# EasyEDA schematic SCH_minir2.json
TITLE: Sheet_1; REV: 1.0; Date: 2022-10-16; Sheet: 1/1; Drawn By: lilili123456; Company: Your Company
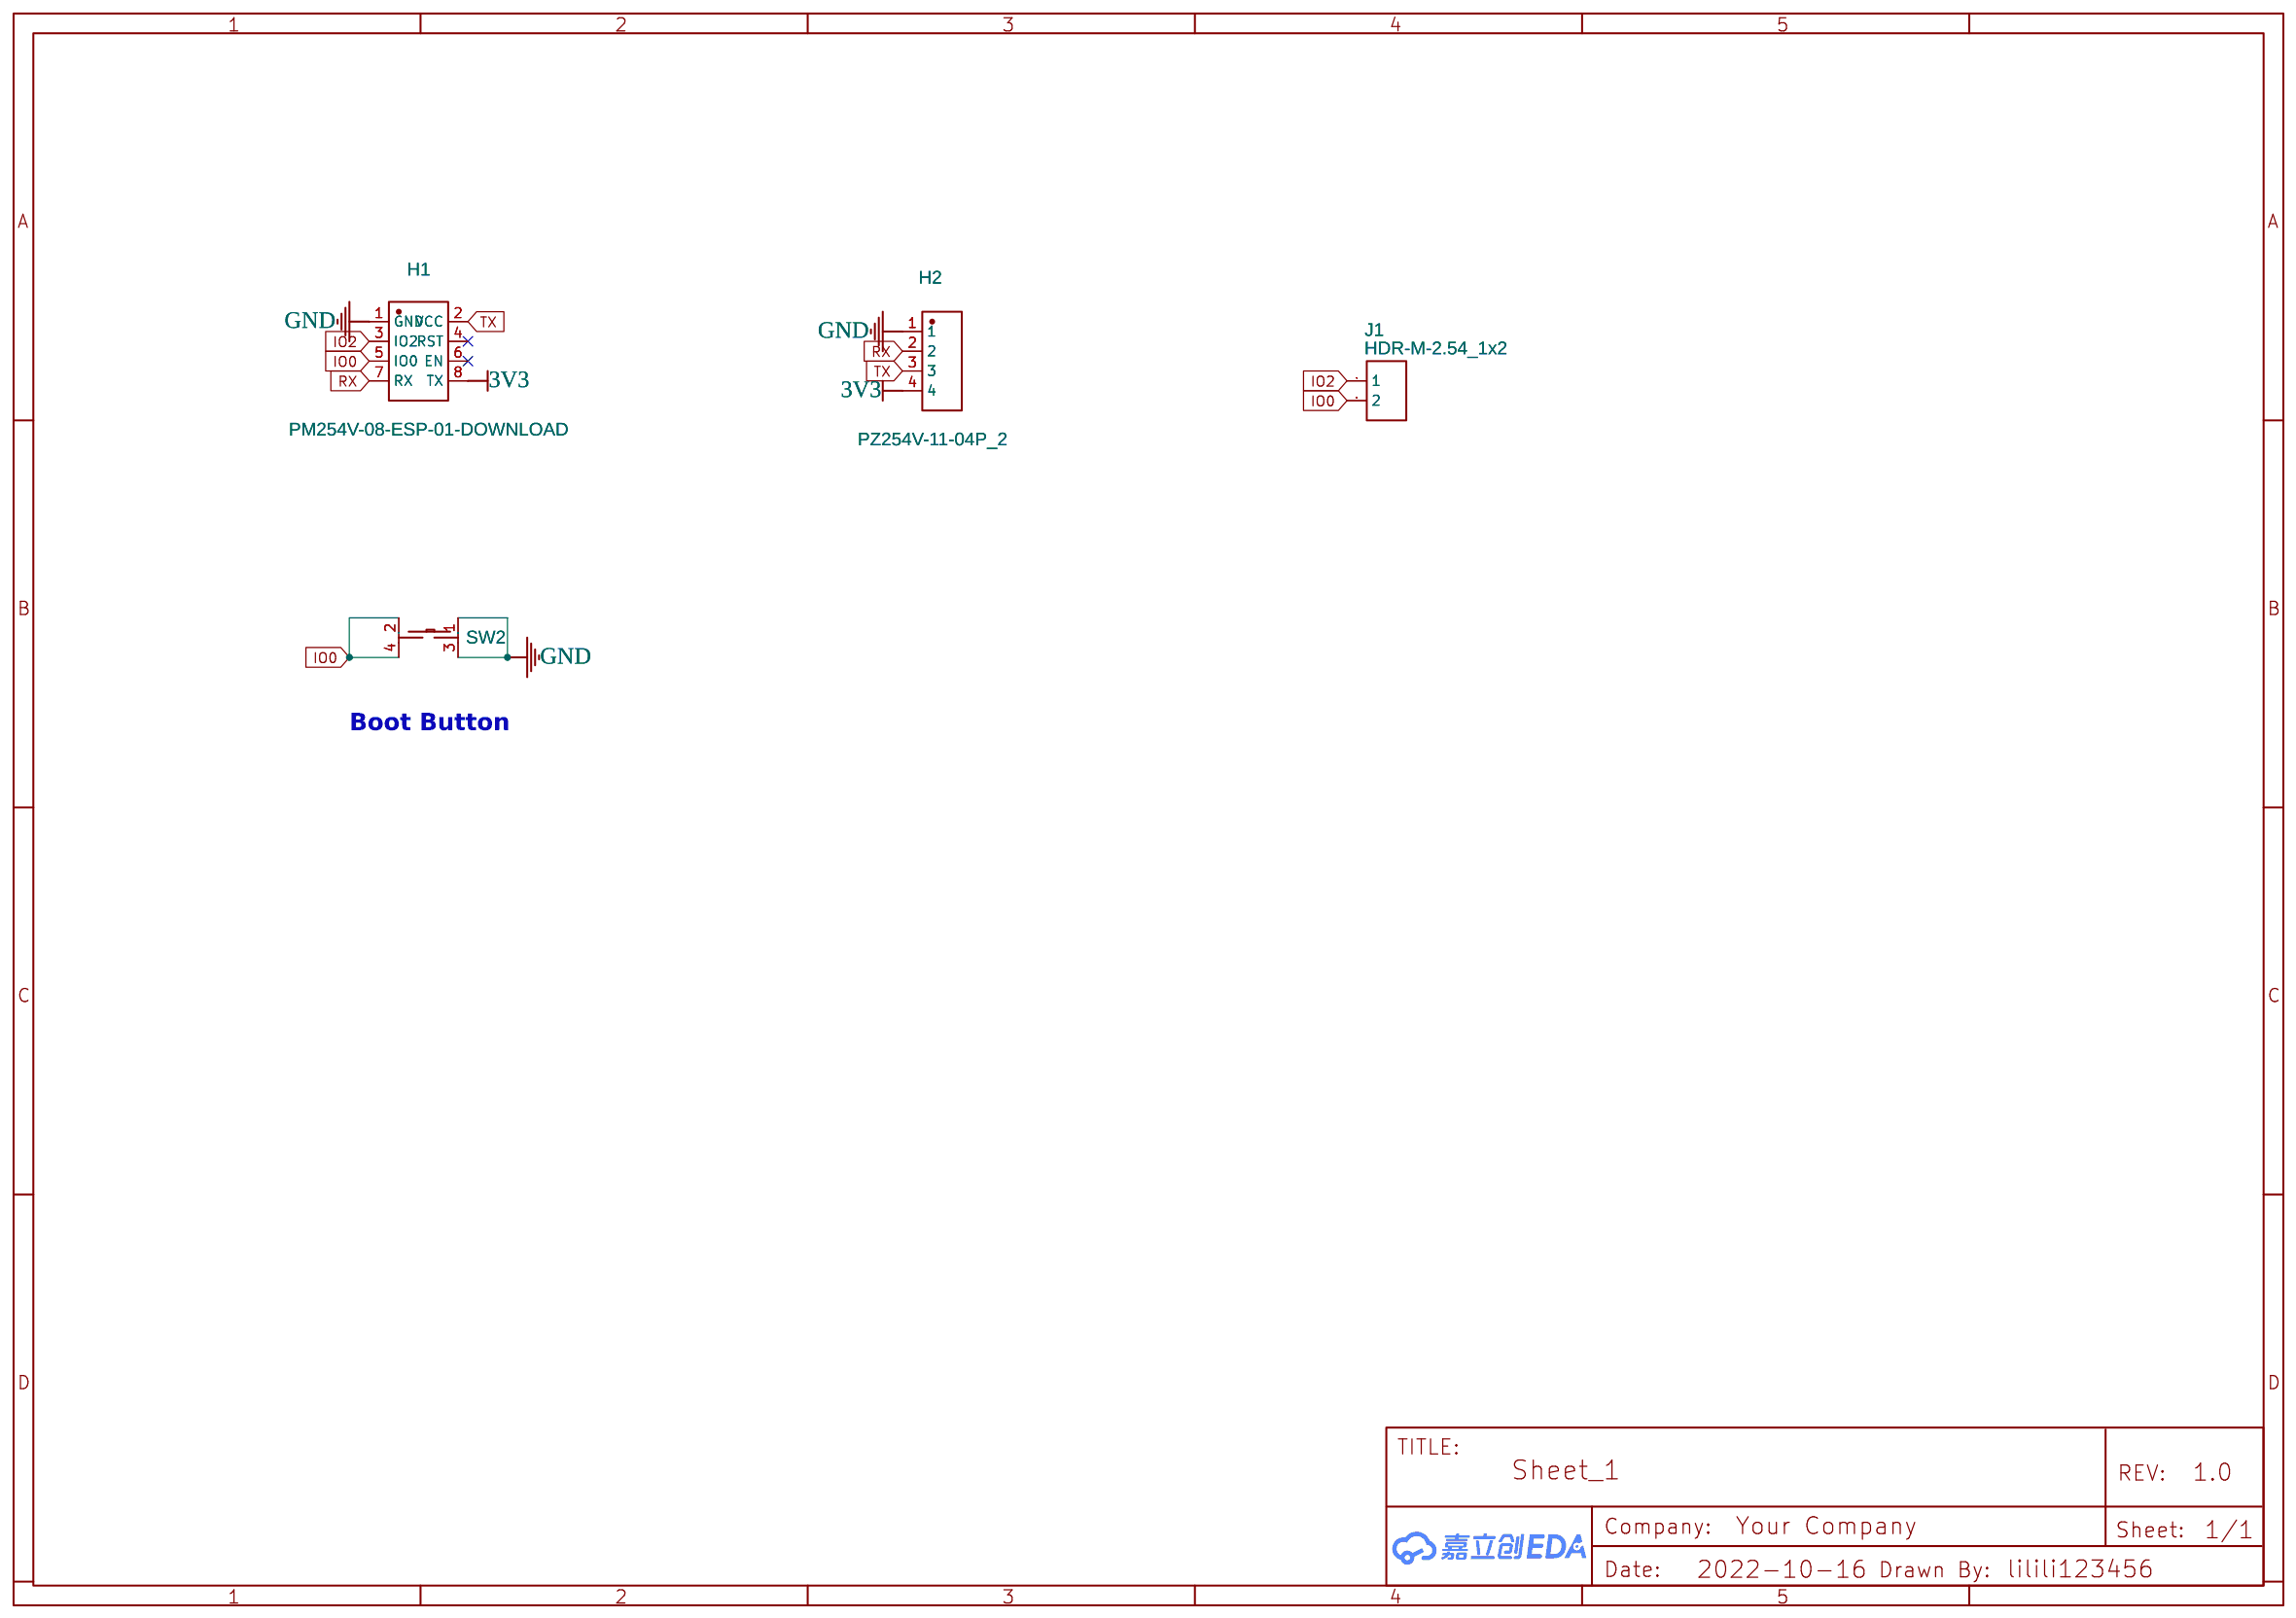
[diagram p0: schematic sheet]

## Parts
H1  PM254V-08-ESP-01-DOWNLOAD  [HDR-TH_8P-P2.54-V-F-DOWNLOAD]
H2  PZ254V-11-04P_2  [HDR-TH_4P-P2.54-V-M]
J1  HDR-M-2.54_1x2  [HDR-M-2.54_1X2]
SW2  K2-1849SN-A3DW-06_LL  [SW-SMD_4P-L3.0-W2.8-P1.7-LS3.5]

## Library data of the parts
H1 = PM254V-08-ESP-01-DOWNLOAD: Supplier: LCSC; Supplier Part: C2834799; Manufacturer: XFCN(台湾兴飞); Manufacturer Part: PM254V-12-08-H85; Contributor: lilili123456; JLCPCB Part Class: Extended Part; Convert to PCB: Yes; Add into BOM: Yes
H2 = PZ254V-11-04P_2: Supplier: LCSC; Supplier Part: C2691448; Manufacturer: XFCN(台湾兴飞); Manufacturer Part: PZ254V-11-04P; Contributor: lilili123456; JLCPCB Part Class: Extended Part
J1 = HDR-M-2.54_1x2: Supplier Part: C124375; Supplier: LCSC; Contributor: LCEDA_Lib
SW2 = K2-1849SN-A3DW-06_LL: Supplier: LCSC; Supplier Part: C442593; Manufacturer: Korean Hroparts Elec; Manufacturer Part: K2-1849SN-A3DW-06; Contributor: lilili123456; JLCPCB Part Class: Extended Part

## Nets
3V3: H1.8(TX) H2.4
GND: H1.1(GND) H2.1 SW2.1 SW2.3
IO0: H1.5(IO0) J1.2 SW2.2 SW2.4
IO2: H1.3(IO2) J1.1
RX: H1.7(RX) H2.2
TX: H1.2(VCC) H2.3

Not connected (* = marked no-connect by the designer): H1 4(RST)* 6(EN)*

## Notes on the sheet
- Boot Button
